# Altium schematic sheet FPGA_HDMI_IN_OUT.SchDoc
size A3; SheetNumber: 8; SheetTotal: 22
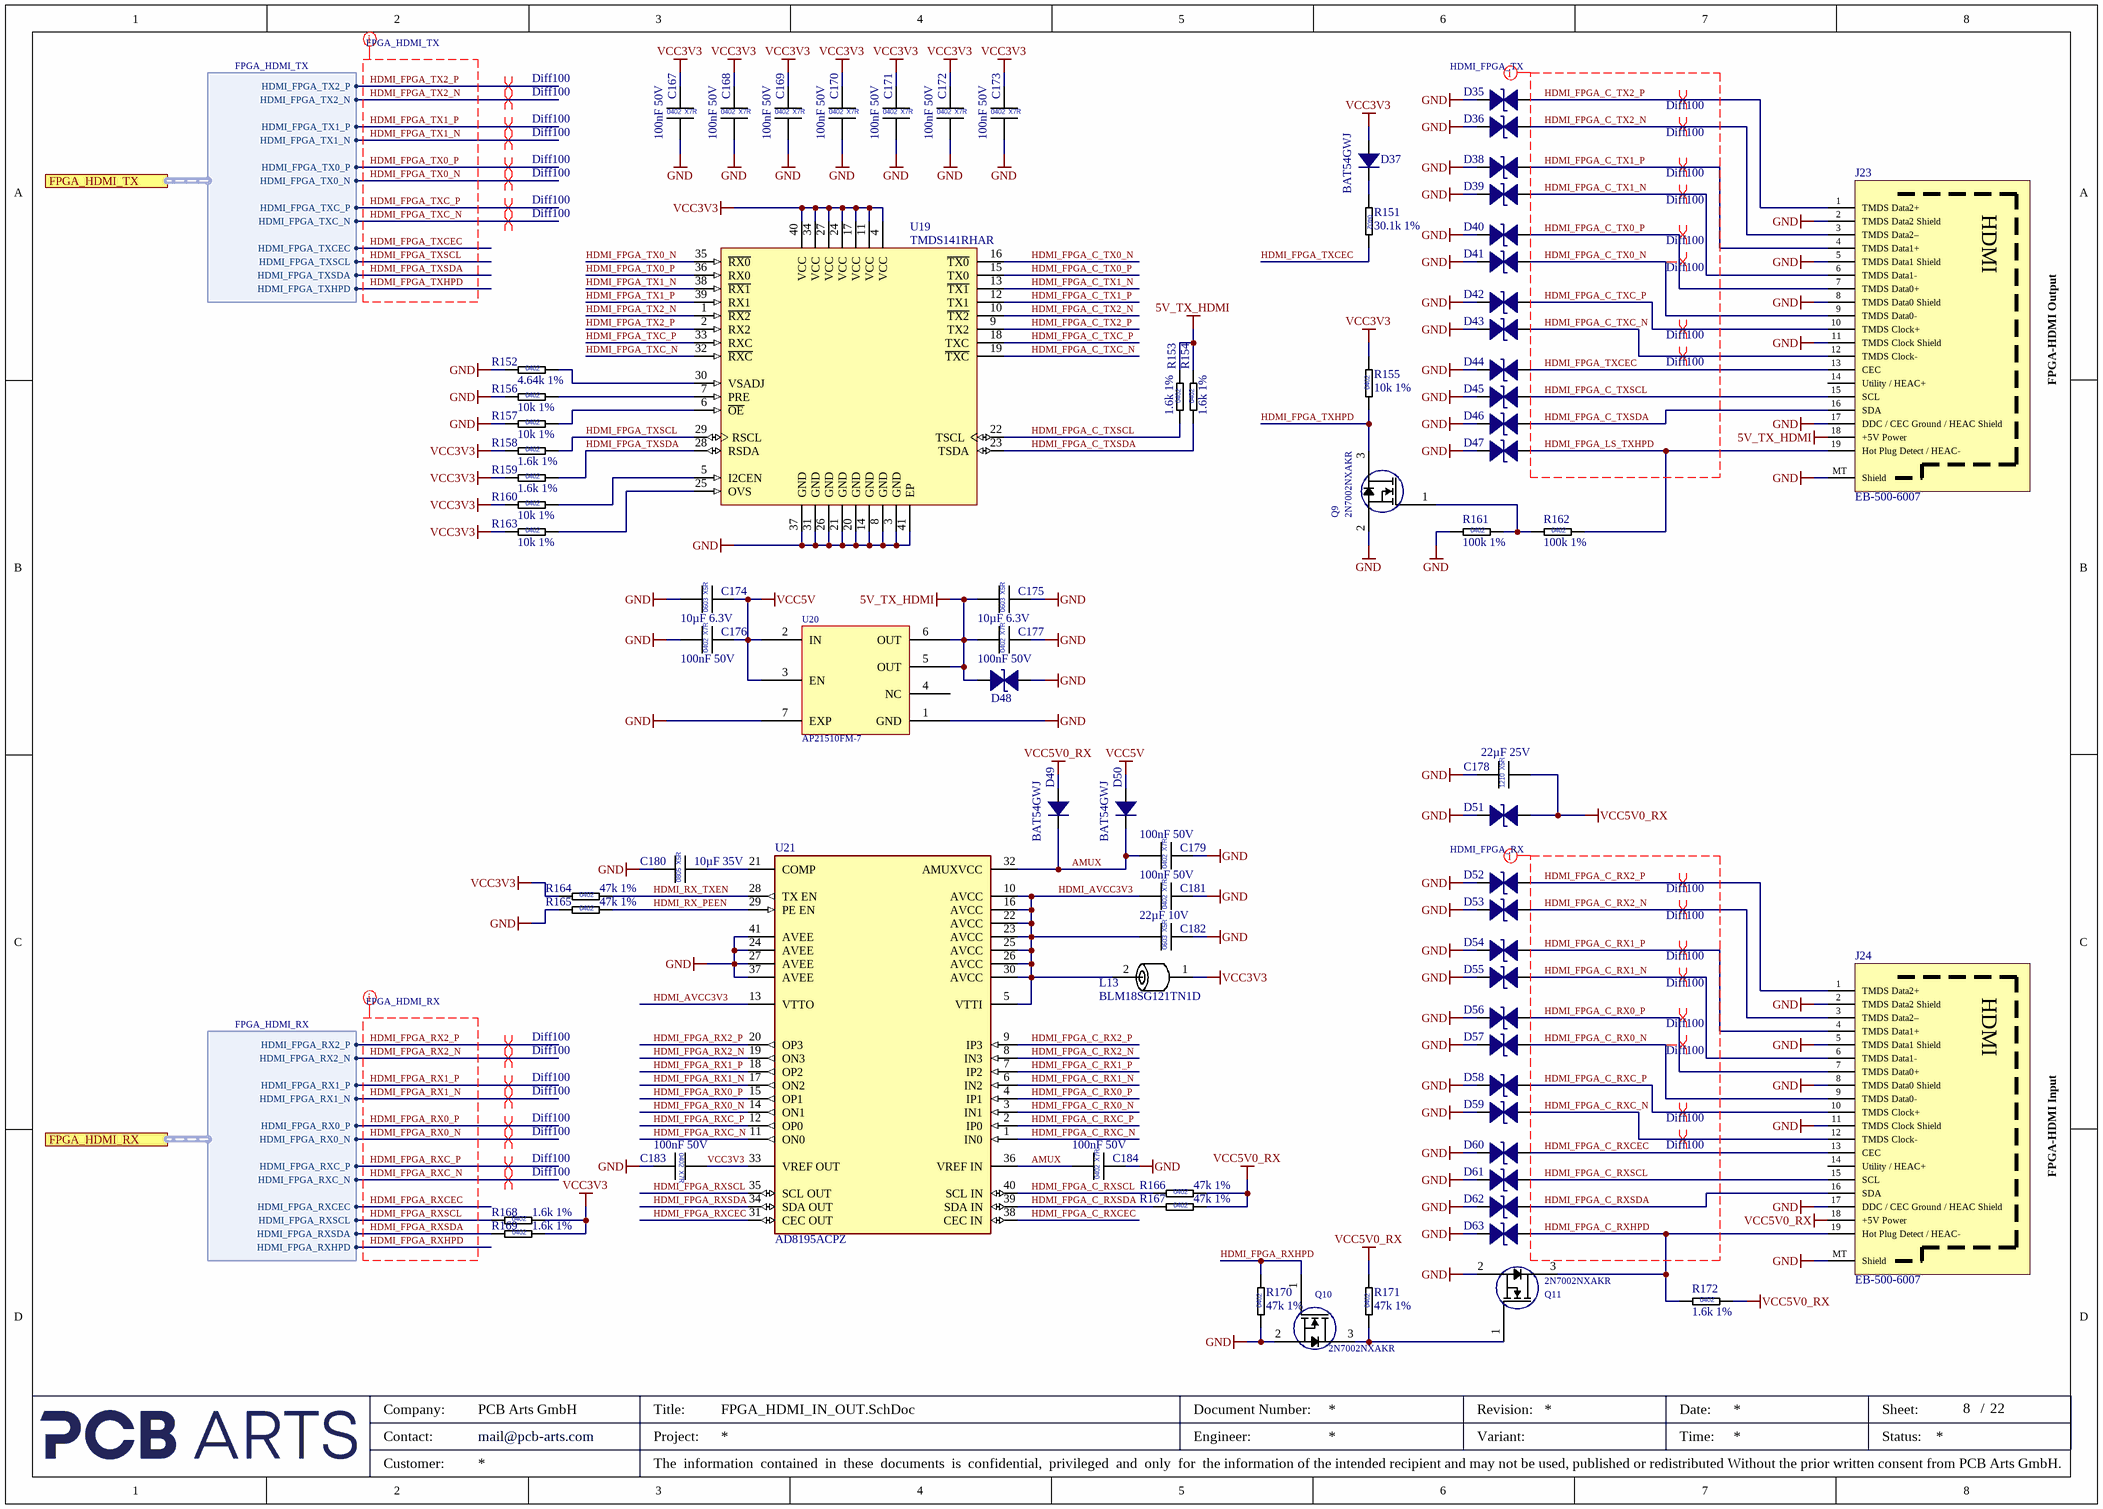
[diagram p0: FPGA_HDMI_IN_OUT.SchDoc]

## Parts
C167  100nF 50V  [CAP_0402_L]
C168  100nF 50V  [CAP_0402_L]
C169  100nF 50V  [CAP_0402_L]
C170  100nF 50V  [CAP_0402_L]
C171  100nF 50V  [CAP_0402_L]
C172  100nF 50V  [CAP_0402_L]
C173  100nF 50V  [CAP_0402_L]
C174  10µF 6.3V  [CAP_0603_L]
C175  10µF 6.3V  [CAP_0603_L]
C176  100nF 50V  [CAP_0402_L]
C177  100nF 50V  [CAP_0402_L]
C178  22µF 25V  [CAP_1210]
C179  100nF 50V  [CAP_0402_L]
C180  10µF 35V  [CAP_0805]
C181  100nF 50V  [CAP_0402_L]
C182  22µF 10V  [CAP_0603_L]
C183  100nF 50V  [CAP_0402_L]
C184  100nF 50V  [CAP_0402_L]
D35  CESDP0402UC5VB  [TVS_0402]  (value not drawn)
D36  CESDP0402UC5VB  [TVS_0402]  (value not drawn)
D37  BAT54GWJ  [SOD123]
D38  CESDP0402UC5VB  [TVS_0402]  (value not drawn)
D39  CESDP0402UC5VB  [TVS_0402]  (value not drawn)
D40  CESDP0402UC5VB  [TVS_0402]  (value not drawn)
D41  CESDP0402UC5VB  [TVS_0402]  (value not drawn)
D42  CESDP0402UC5VB  [TVS_0402]  (value not drawn)
D43  CESDP0402UC5VB  [TVS_0402]  (value not drawn)
D44  CESDP0402UC5VB  [TVS_0402]  (value not drawn)
D45  CESDP0402UC5VB  [TVS_0402]  (value not drawn)
D46  CESDP0402UC5VB  [TVS_0402]  (value not drawn)
D47  CESDP0402UC5VB  [TVS_0402]  (value not drawn)
D48  CESDP0402UC5VB  [TVS_0402]  (value not drawn)
D49  BAT54GWJ  [SOD123]
D50  BAT54GWJ  [SOD123]
D51  CESDP0402UC5VB  [TVS_0402]  (value not drawn)
D52  CESDP0402UC5VB  [TVS_0402]  (value not drawn)
D53  CESDP0402UC5VB  [TVS_0402]  (value not drawn)
D54  CESDP0402UC5VB  [TVS_0402]  (value not drawn)
D55  CESDP0402UC5VB  [TVS_0402]  (value not drawn)
D56  CESDP0402UC5VB  [TVS_0402]  (value not drawn)
D57  CESDP0402UC5VB  [TVS_0402]  (value not drawn)
D58  CESDP0402UC5VB  [TVS_0402]  (value not drawn)
D59  CESDP0402UC5VB  [TVS_0402]  (value not drawn)
D60  CESDP0402UC5VB  [TVS_0402]  (value not drawn)
D61  CESDP0402UC5VB  [TVS_0402]  (value not drawn)
D62  CESDP0402UC5VB  [TVS_0402]  (value not drawn)
D63  CESDP0402UC5VB  [TVS_0402]  (value not drawn)
J23  EB-500-6007  [Elecbee EB-500-6007]
J24  EB-500-6007  [Elecbee EB-500-6007]
L13  BLM18SG121TN1D  [L_0603]
Q9  2N7002NXAKR  [SOT95P251X112-3N]
Q10  2N7002NXAKR  [SOT95P251X112-3N]
Q11  2N7002NXAKR  [SOT95P251X112-3N]
R151  30.1k 1%  [RES_0402_L]
R152  4.64k 1%  [RES_0402_L]
R153  1.6k 1%  [RES_0402_L]
R154  1.6k 1%  [RES_0402_L]
R155  10k 1%  [RES_0402_L]
R156  10k 1%  [RES_0402_L]
R157  10k 1%  [RES_0402_L]
R158  1.6k 1%  [RES_0402_L]
R159  1.6k 1%  [RES_0402_L]
R160  10k 1%  [RES_0402_L]
R161  100k 1%  [RES_0402_L]
R162  100k 1%  [RES_0402_L]
R163  10k 1%  [RES_0402_L]
R164  47k 1%  [RES_0402_L]
R165  47k 1%  [RES_0402_L]
R166  47k 1%  [RES_0402_L]
R167  47k 1%  [RES_0402_L]
R168  1.6k 1%  [RES_0402_L]
R169  1.6k 1%  [RES_0402_L]
R170  47k 1%  [RES_0402_L]
R171  47k 1%  [RES_0402_L]
R172  1.6k 1%  [RES_0402_L]
U19  TMDS141RHAR  [QFN50P600X600X100-41N]
U20  AP21510FM-7  [QFN50P201X181X60_HS-7N]
U21  AD8195ACPZ  [QFN50P600X600X100-41N]

## Ports
FPGA_HDMI_RX (harness FPGA_HDMI_RX, see Top-Level-Sheet[6B], Bank 13_Bank 15_Bank 16[8B]), FPGA_HDMI_TX (harness FPGA_HDMI_TX, see Top-Level-Sheet[6B], Bank 13_Bank 15_Bank 16[8A])

## Harnesses
FPGA_HDMI_TX: HDMI_FPGA_TX2_P, HDMI_FPGA_TX2_N, HDMI_FPGA_TX1_P, HDMI_FPGA_TX1_N, HDMI_FPGA_TX0_P, HDMI_FPGA_TX0_N, HDMI_FPGA_TXC_P, HDMI_FPGA_TXC_N, HDMI_FPGA_TXCEC, HDMI_FPGA_TXSCL, HDMI_FPGA_TXSDA, HDMI_FPGA_TXHPD
FPGA_HDMI_RX: HDMI_FPGA_RX2_P, HDMI_FPGA_RX2_N, HDMI_FPGA_RX1_P, HDMI_FPGA_RX1_N, HDMI_FPGA_RX0_P, HDMI_FPGA_RX0_N, HDMI_FPGA_RXC_P, HDMI_FPGA_RXC_N, HDMI_FPGA_RXCEC, HDMI_FPGA_RXSCL, HDMI_FPGA_RXSDA, HDMI_FPGA_RXHPD

## Nets
5V_TX_HDMI: C175.1 C177.1 D48.1 J23.18(+5V_Power) R153.2 R154.2 U20.5(OUT) U20.6(OUT)
GND: C167.2 C168.2 C169.2 C170.2 C171.2 C172.2 C173.2 C174.1 C175.2 C176.1 C177.2 C178.1 C179.2 C180.1 C181.2 C182.2 C183.2 C184.2 D35.1 D36.1 D38.1 D39.1 D40.1 D41.1 D42.1 D43.1 D44.1 D45.1 D46.1 D47.1 D48.2 D51.1 D52.1 D53.1 D54.1 D55.1 D56.1 D57.1 D58.1 D59.1 D60.1 D61.1 D62.1 D63.1 J23.2(TMDS_Data2_Shield) J23.5(TMDS_Data1_Shield) J23.8(TMDS_Data0_Shield) J23.11(TMDS_Clock_Shield) J23.17(DDC_/_CEC_Ground_/_HEAC_Shield) J23.MT(Shield) J24.2(TMDS_Data2_Shield) J24.5(TMDS_Data1_Shield) J24.8(TMDS_Data0_Shield) J24.11(TMDS_Clock_Shield) J24.17(DDC_/_CEC_Ground_/_HEAC_Shield) J24.MT(Shield) Q9.2(S) Q10.2(S) Q11.2(S) R152.1 R156.1 R157.1 R161.1 R165.1 R170.1 U19.3(GND) U19.8(GND) U19.14(GND) U19.20(GND) U19.21(GND) U19.26(GND) U19.31(GND) U19.37(GND) U19.41(EP) U20.1(GND) U20.7(EXP) U21.24(AVEE) U21.27(AVEE) U21.37(AVEE) U21.41(AVEE)
VCC3V3: C167.1 C168.1 C169.1 C170.1 C171.1 C172.1 C173.1 C183.1 D37.2 L13.1 R155.2 R158.1 R159.1 R160.1 R163.1 R164.1 R168.2 R169.2 U19.4(VCC) U19.11(VCC) U19.17(VCC) U19.24(VCC) U19.27(VCC) U19.34(VCC) U19.40(VCC) U21.33(VREF_OUT)
VCC5V: C174.2 C176.2 D50.2 U20.2(IN) U20.3(EN)
VCC5V0_RX: C178.2 D49.2 D51.2 J24.18(+5V_Power) R166.2 R167.2 R171.2 R172.2
AMUX: C179.1 C184.1 D49.1 D50.1 U21.32(AMUXVCC) U21.36(VREF_IN)
HDMI_AVCC3V3: C181.1 C182.1 L13.2 U21.5(VTTI) U21.10(AVCC) U21.13(VTTO) U21.16(AVCC) U21.22(AVCC) U21.23(AVCC) U21.25(AVCC) U21.26(AVCC) U21.30(AVCC)
HDMI_FPGA_C_RX0_N: D57.2 J24.9(TMDS_Data0-) U21.3(IN1)
HDMI_FPGA_C_RX0_P: D56.2 J24.7(TMDS_Data0+) U21.4(IP1)
HDMI_FPGA_C_RX1_N: D55.2 J24.6(TMDS_Data1-) U21.6(IN2)
HDMI_FPGA_C_RX1_P: D54.2 J24.4(TMDS_Data1+) U21.7(IP2)
HDMI_FPGA_C_RX2_N: D53.2 J24.3(TMDS_Data2–) U21.8(IN3)
HDMI_FPGA_C_RX2_P: D52.2 J24.1(TMDS_Data2+) U21.9(IP3)
HDMI_FPGA_C_RXC_N: D59.2 J24.12(TMDS_Clock-) U21.1(IN0)
HDMI_FPGA_C_RXC_P: D58.2 J24.10(TMDS_Clock+) U21.2(IP0)
HDMI_FPGA_C_RXCEC: D60.2 J24.13(CEC) U21.38(CEC_IN)
HDMI_FPGA_C_RXHPD: D63.2 J24.19(Hot_Plug_Detect_/_HEAC-) Q11.3(D) R172.1
HDMI_FPGA_C_RXSCL: D61.2 J24.15(SCL) R166.1 U21.40(SCL_IN)
HDMI_FPGA_C_RXSDA: D62.2 J24.16(SDA) R167.1 U21.39(SDA_IN)
HDMI_FPGA_C_TX0_N: D41.2 J23.9(TMDS_Data0-) U19.16(~{TX0})
HDMI_FPGA_C_TX0_P: D40.2 J23.7(TMDS_Data0+) U19.15(TX0)
HDMI_FPGA_C_TX1_N: D39.2 J23.6(TMDS_Data1-) U19.13(~{TX1})
HDMI_FPGA_C_TX1_P: D38.2 J23.4(TMDS_Data1+) U19.12(TX1)
HDMI_FPGA_C_TX2_N: D36.2 J23.3(TMDS_Data2–) U19.10(~{TX2})
HDMI_FPGA_C_TX2_P: D35.2 J23.1(TMDS_Data2+) U19.9(TX2)
HDMI_FPGA_C_TXC_N: D43.2 J23.12(TMDS_Clock-) U19.19(~{TXC})
HDMI_FPGA_C_TXC_P: D42.2 J23.10(TMDS_Clock+) U19.18(TXC)
HDMI_FPGA_C_TXSCL: D45.2 J23.15(SCL) R153.1 U19.22(TSCL)
HDMI_FPGA_C_TXSDA: D46.2 J23.16(SDA) R154.1 U19.23(TSDA)
HDMI_FPGA_LS_TXHPD: D47.2 J23.19(Hot_Plug_Detect_/_HEAC-) R162.2
HDMI_FPGA_RX0_N: U21.14(ON1) ; port FPGA_HDMI_RX.HDMI_FPGA_RX0_N
HDMI_FPGA_RX0_P: U21.15(OP1) ; port FPGA_HDMI_RX.HDMI_FPGA_RX0_P
HDMI_FPGA_RX1_N: U21.17(ON2) ; port FPGA_HDMI_RX.HDMI_FPGA_RX1_N
HDMI_FPGA_RX1_P: U21.18(OP2) ; port FPGA_HDMI_RX.HDMI_FPGA_RX1_P
HDMI_FPGA_RX2_N: U21.19(ON3) ; port FPGA_HDMI_RX.HDMI_FPGA_RX2_N
HDMI_FPGA_RX2_P: U21.20(OP3) ; port FPGA_HDMI_RX.HDMI_FPGA_RX2_P
HDMI_FPGA_RXC_N: U21.11(ON0) ; port FPGA_HDMI_RX.HDMI_FPGA_RXC_N
HDMI_FPGA_RXC_P: U21.12(OP0) ; port FPGA_HDMI_RX.HDMI_FPGA_RXC_P
HDMI_FPGA_RXCEC: U21.31(CEC_OUT) ; port FPGA_HDMI_RX.HDMI_FPGA_RXCEC
HDMI_FPGA_RXHPD: Q10.1(G) R170.2 ; port FPGA_HDMI_RX.HDMI_FPGA_RXHPD
HDMI_FPGA_RXSCL: R168.1 U21.35(SCL_OUT) ; port FPGA_HDMI_RX.HDMI_FPGA_RXSCL
HDMI_FPGA_RXSDA: R169.1 U21.34(SDA_OUT) ; port FPGA_HDMI_RX.HDMI_FPGA_RXSDA
HDMI_FPGA_TX0_N: U19.35(~{RX0}) ; port FPGA_HDMI_TX.HDMI_FPGA_TX0_N
HDMI_FPGA_TX0_P: U19.36(RX0) ; port FPGA_HDMI_TX.HDMI_FPGA_TX0_P
HDMI_FPGA_TX1_N: U19.38(~{RX1}) ; port FPGA_HDMI_TX.HDMI_FPGA_TX1_N
HDMI_FPGA_TX1_P: U19.39(RX1) ; port FPGA_HDMI_TX.HDMI_FPGA_TX1_P
HDMI_FPGA_TX2_N: U19.1(~{RX2}) ; port FPGA_HDMI_TX.HDMI_FPGA_TX2_N
HDMI_FPGA_TX2_P: U19.2(RX2) ; port FPGA_HDMI_TX.HDMI_FPGA_TX2_P
HDMI_FPGA_TXC_N: U19.32(~{RXC}) ; port FPGA_HDMI_TX.HDMI_FPGA_TXC_N
HDMI_FPGA_TXC_P: U19.33(RXC) ; port FPGA_HDMI_TX.HDMI_FPGA_TXC_P
HDMI_FPGA_TXCEC: D44.2 J23.13(CEC) R151.2 ; port FPGA_HDMI_TX.HDMI_FPGA_TXCEC
HDMI_FPGA_TXHPD: Q9.3(D) R155.1 ; port FPGA_HDMI_TX.HDMI_FPGA_TXHPD
HDMI_FPGA_TXSCL: R158.2 U19.29(RSCL) ; port FPGA_HDMI_TX.HDMI_FPGA_TXSCL
HDMI_FPGA_TXSDA: R159.2 U19.28(RSDA) ; port FPGA_HDMI_TX.HDMI_FPGA_TXSDA
HDMI_RX_PEEN: R165.2 U21.29(PE_EN)
HDMI_RX_TXEN: R164.2 U21.28(TX_EN)
NetC180_2: C180.2 U21.21(COMP)
NetD37_1: D37.1 R151.1
NetQ9_1: Q9.1(G) R161.2 R162.1
NetQ10_3: Q10.3(D) Q11.1(G) R171.1
NetR152_2: R152.2 U19.30(VSADJ)
NetR156_2: R156.2 U19.7(PRE)
NetR157_2: R157.2 U19.6(~{OE})
NetR160_2: R160.2 U19.5(I2CEN)
NetR163_2: R163.2 U19.25(OVS)

Not connected (* = marked no-connect by the designer): J23 14(Utility_/_HEAC+); J24 14(Utility_/_HEAC+); U20 4(NC)

## Layout directives
net class HDMI_FPGA_TX: HDMI_FPGA_C_TX0_N, HDMI_FPGA_C_TX0_P, HDMI_FPGA_C_TX1_N, HDMI_FPGA_C_TX1_P, HDMI_FPGA_C_TX2_N, HDMI_FPGA_C_TX2_P, HDMI_FPGA_C_TXC_N, HDMI_FPGA_C_TXC_P, HDMI_FPGA_C_TXSCL, HDMI_FPGA_C_TXSDA, HDMI_FPGA_LS_TXHPD, HDMI_FPGA_TXCEC
net class HDMI_FPGA_RX: HDMI_FPGA_C_RX0_N, HDMI_FPGA_C_RX0_P, HDMI_FPGA_C_RX1_N, HDMI_FPGA_C_RX1_P, HDMI_FPGA_C_RX2_N, HDMI_FPGA_C_RX2_P, HDMI_FPGA_C_RXC_N, HDMI_FPGA_C_RXC_P, HDMI_FPGA_C_RXCEC, HDMI_FPGA_C_RXHPD, HDMI_FPGA_C_RXSCL, HDMI_FPGA_C_RXSDA
differential pair; net class Diff100: HDMI_FPGA_C_RX0_N, HDMI_FPGA_C_RX0_P, HDMI_FPGA_C_RX1_N, HDMI_FPGA_C_RX1_P, HDMI_FPGA_C_RX2_N, HDMI_FPGA_C_RX2_P, HDMI_FPGA_C_RXC_N, HDMI_FPGA_C_RXC_P, HDMI_FPGA_C_TX0_N, HDMI_FPGA_C_TX0_P, HDMI_FPGA_C_TX1_N, HDMI_FPGA_C_TX1_P, HDMI_FPGA_C_TX2_N, HDMI_FPGA_C_TX2_P, HDMI_FPGA_C_TXC_N, HDMI_FPGA_C_TXC_P, HDMI_FPGA_RX0_N, HDMI_FPGA_RX0_P, HDMI_FPGA_RX1_N, HDMI_FPGA_RX1_P, HDMI_FPGA_RX2_N, HDMI_FPGA_RX2_P, HDMI_FPGA_RXC_N, HDMI_FPGA_RXC_P, HDMI_FPGA_TX0_N, HDMI_FPGA_TX0_P, HDMI_FPGA_TX1_N, HDMI_FPGA_TX1_P, HDMI_FPGA_TX2_N, HDMI_FPGA_TX2_P, HDMI_FPGA_TXC_N, HDMI_FPGA_TXC_P
net class FPGA_HDMI_TX: HDMI_FPGA_TX0_N, HDMI_FPGA_TX0_P, HDMI_FPGA_TX1_N, HDMI_FPGA_TX1_P, HDMI_FPGA_TX2_N, HDMI_FPGA_TX2_P, HDMI_FPGA_TXC_N, HDMI_FPGA_TXC_P, HDMI_FPGA_TXCEC, HDMI_FPGA_TXHPD, HDMI_FPGA_TXSCL, HDMI_FPGA_TXSDA
net class FPGA_HDMI_RX: HDMI_FPGA_RX0_N, HDMI_FPGA_RX0_P, HDMI_FPGA_RX1_N, HDMI_FPGA_RX1_P, HDMI_FPGA_RX2_N, HDMI_FPGA_RX2_P, HDMI_FPGA_RXC_N, HDMI_FPGA_RXC_P, HDMI_FPGA_RXCEC, HDMI_FPGA_RXHPD, HDMI_FPGA_RXSCL, HDMI_FPGA_RXSDA

## Notes on the sheet
- FPGA-HDMI Output
- FPGA-HDMI Input
- Company:
- Contact:
- Customer:
- mail@pcb-arts.com
- PCB Arts GmbH
- Title:
- Project:
- The  information  contained  in  these  documents  is  confidential,  privileged  and  only  for  the information of the intended recipient and may not be used, published or redistributed Without the prior written consent from PCB Arts GmbH.
- Engineer:
- Document Number:
- Revision:
- Variant:
- Date:
- Time:
- Sheet:
- Status:
- /
- (in symbol CAP_0402_100nF_50V) X7R; 0402
- (in symbol CAP_0603_10µF_6.3V) X5R; 0603
- (in symbol CAP_0603_22µF_10V) X5R; 0603
- (in symbol CAP_0805_10µF_35V) X5R; 0805
- (in symbol CAP_1210_22µF_25V) X5R; 1210
- (in symbol EB-500-6007_HDMI Connector 19Pin Vertical THT) HDMI
- (in symbol RES_0402_1.6k_1%) 0402
- (in symbol RES_0402_4.64k_1%) 0402
- (in symbol RES_0402_10k_1%) 0402
- (in symbol RES_0402_30.1k_1%) 0402
- (in symbol RES_0402_47k_1%) 0402
- (in symbol RES_0402_100k_1%) 0402

## Library data of the parts
C167-C173 C176 C177 C179 C181 C183 C184 = CAP_0402_100nF_50V: Multilayer Ceramic Capacitors MLCC - SMD/SMT 0402 50VDC; Manufacturer 1: Murata Electronics; Manufacturer 1 Prt. Nr.: GCM155L8EH104KE07D; Manufacturer 2 Prt. Nr.: UMK105B7104KV-FR; Manufacturer 2: TDK
C174 C175 = CAP_0603_10µF_6.3V: Multilayer Ceramic Capacitors MLCC - SMD/SMT 0603 6.3VDC; Manufacturer 1: Murata Electronics; Manufacturer 1 Prt. Nr.: GRM188R60J106ME84J; Manufacturer 2 Prt. Nr.: JMK107ABJ106MA-T; Manufacturer 2: Taiyo Yuden
C178 = CAP_1210_22µF_25V: Multilayer Ceramic Capacitors MLCC - SMD/SMT 1210 25VDC; Manufacturer 1: KEMET; Manufacturer 1 Prt. Nr.: C1210C226K3PACTU; Manufacturer 2 Prt. Nr.: TMK212BBJ226MG-TT; Manufacturer 2: Taiyo Yuden
C180 = CAP_0805_10µF_35V: Multilayer Ceramic Capacitors MLCC - SMD/SMT 0805 35VDC; Manufacturer 1: Murata Electronics; Manufacturer 1 Prt. Nr.: GRM21BR6YA106ME43L; Manufacturer 2 Prt. Nr.: C2012X5R1V106M085AC; Manufacturer 2: TDK
C182 = CAP_0603_22µF_10V: Multilayer Ceramic Capacitors MLCC - SMD/SMT 0603 10VDC; Manufacturer 1: Samsung Electro-Mechanics; Manufacturer 1 Prt. Nr.: CL10A226MP8NUNE; Manufacturer 2 Prt. Nr.: GRM188R61A226ME15D; Manufacturer 2: Murata Electronics
D35 D36 D38-D48 D51-D63 = CESDP0402UC5VB_TVS Diode 0402: Low Capacitance ESD Protection Diode 0402; Manufacturer 1: CREATEK; Manufacturer 2 Prt. Nr.: BPESD0402-05ST; Manufacturer 1 Prt. Nr.: CESDP0402UC5VB; Manufacturer 2: BORN
D37 D49 D50 = BAT54GWJ_Schottky Diode 30V, 200mA: Schottky Diode 30V, 200mA; Manufacturer 1: Nexperia; Manufacturer 2 Prt. Nr.: BAT54T1G; Manufacturer 1 Prt. Nr.: BAT54GWJ; Manufacturer 2: onsemi
J23 J24 = EB-500-6007_HDMI Connector 19Pin Vertical THT: HDMI Connector Female Vertical 19 Pin; Manufacturer 1: Elecbee; Manufacturer 1 Prt. Nr.: EB-500-6007
L13 = BLM18SG121TN1D_Ferrite Beads 0603 120Ohms 3000mA: Ferritperlen BLM18_xN 0603 100MHz 120Ohm 3000mA 25mOhm RSER; Manufacturer 1: Murata Electronics; Manufacturer 1 Prt. Nr.: BLM18SG121TN1D
Q9-Q11 = 2N7002NXAKR_MOSFET 60V SGL N-CH TRENCHMOS: MOSFET 60V SGL N-CH TRENCHMOS; Manufacturer 1: Nexperia; Manufacturer 1 Prt. Nr.: 2N7002NXAKR
R151 = RES_0402_30.1k_1%: Thick Film Resistors - SMD 30.1kOhm 1%; Manufacturer 1: Vishay / Dale; Manufacturer 1 Prt. Nr.: CRCW040230K1FKEDC; Manufacturer 2 Prt. Nr.: RC0402FR-1330K1L; Manufacturer 2: Yageo
R152 = RES_0402_4.64k_1%: Thick Film Resistors - SMD 4.64kOhm 1%; Manufacturer 1: Vishay / Dale; Manufacturer 1 Prt. Nr.: CRCW04024K64FKEDC; Manufacturer 2 Prt. Nr.: RC0402FR-134K64L; Manufacturer 2: Yageo
R153 R154 R158 R159 R168 R169 R172 = RES_0402_1.6k_1%: Thick Film Resistors - SMD 1.6kOhm 1%; Manufacturer 1: Vishay / Dale; Manufacturer 1 Prt. Nr.: CRCW04021K60FKEDC; Manufacturer 2 Prt. Nr.: RC0402FR-7W1K6L; Manufacturer 2: Yageo
R155-R157 R160 R163 = RES_0402_10k_1%: Thick Film Resistors - SMD 10kOhm 1%; Manufacturer 1: Vishay / Dale; Manufacturer 1 Prt. Nr.: CRCW040210K0FKEDC; Manufacturer 2 Prt. Nr.: RC0402FR-7W10KL; Manufacturer 2: Yageo
R161 R162 = RES_0402_100k_1%: Thick Film Resistors - SMD 100kOhm 1%; Manufacturer 1: Vishay / Dale; Manufacturer 1 Prt. Nr.: CRCW0402100KFKEDC; Manufacturer 2 Prt. Nr.: RC0402FR-7W100KL; Manufacturer 2: Yageo
R164-R167 R170 R171 = RES_0402_47k_1%: Thick Film Resistors - SMD 47kOhm 1%; Manufacturer 1: Vishay / Dale; Manufacturer 1 Prt. Nr.: CRCW040247K0FKEDC; Manufacturer 2 Prt. Nr.: RC0402FR-7W47KL; Manufacturer 2: Yageo
U19 = TMDS141RHAR_HDMI Hider, 130 mA, 6 kV, 0 to +70 degC, 40-pin QFN: HDMI Hider, 130 mA, 6 kV, 0 to +70 degC, 40-pin QFN; Manufacturer 1: Texas Instruments; ComponentLink2Description: Datasheet; ComponentLink1URL: http://www.ti.com/; ComponentLink2URL: http://www.ti.com/general/docs/lit/getliterature.tsp?genericPartNumber=TMDS141&fileType=pdf; ComponentLink3Description: URL Link1; ComponentLink1Description: Manufacturer URL; Manufacturer 1 Prt. Nr.: TMDS141RHAR; ComponentLink3URL: SamplesURL:http://www.ti.com/product/tmds141#samples
U20 = AP21510FM-7_Power Switch ICs - Power Distribution Load Switch: Power Switch ICs - Power Distribution 0.5A SGL Ch USB 2.0 Curr Limited Switch; Manufacturer 1: Diodes Incorporated; Manufacturer 1 Prt. Nr.: AP21510FM-7
U21 = AD8195ACPZ_IC VIDEO HDMI/DVI BUFFER 40LFCSP: IC VIDEO HDMI/DVI BUFFER 40LFCSP; Manufacturer 1: Analog Devices; Manufacturer 1 Prt. Nr.: AD8195ACPZ